# Altium project SkyRacer_V2.0.PrjPcb
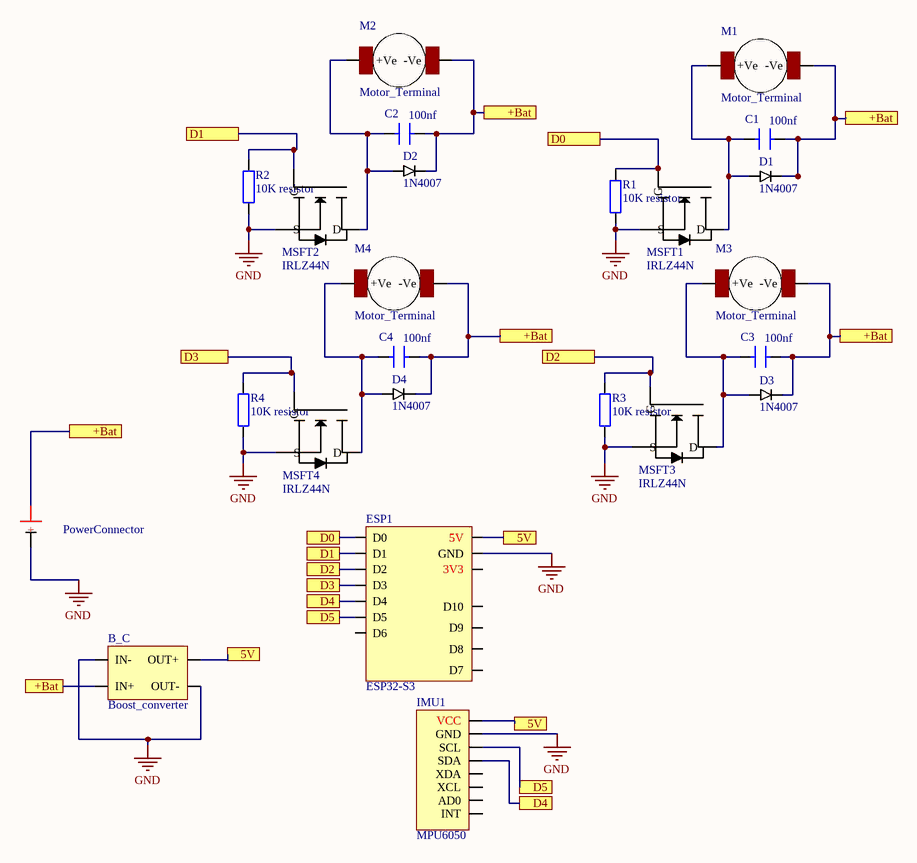
[diagram p0: Schematic.SchDoc]
1 sheet, 24 parts. Net scope: flat (ports and power ports of the same name join across sheets).
Board file: pCb12.PcbDoc

## Sheet Schematic.SchDoc
size A; SheetNumber: 1; SheetTotal: 1

### Parts
B1  PowerConnector  [Power]
B_C  Boost_converter  [Boost_5V]
C1  100nf  [TH_Capacitor]
C2  100nf  [TH_Capacitor]
C3  100nf  [TH_Capacitor]
C4  100nf  [TH_Capacitor]
D1  1N4007  [TH_Diode]
D2  1N4007  [TH_Diode]
D3  1N4007  [TH_Diode]
D4  1N4007  [TH_Diode]
ESP1  ESP32-S3  [ESP-S3-Seed-Studio]
IMU1  MPU6050  [MPU-8-pins]
M1  Motor_Terminal  [Motor Connector]
M2  Motor_Terminal  [Motor Connector]
M3  Motor_Terminal  [Motor Connector]
M4  Motor_Terminal  [Motor Connector]
MSFT1  IRLZ44N  [TH_MOSFET_IRLB8721]
MSFT2  IRLZ44N  [TH_MOSFET_IRLB8721]
MSFT3  IRLZ44N  [TH_MOSFET_IRLB8721]
MSFT4  IRLZ44N  [TH_MOSFET_IRLB8721]
R1  10K resistor  [TH_resistor]
R2  10K resistor  [TH_resistor]
R3  10K resistor  [TH_resistor]
R4  10K resistor  [TH_resistor]

### Ports
5V, +Bat, D0, D1, D2, D3, D4, D5

### Nets
GND: B1.2(-) B_C.2(IN-) B_C.4(OUT-) ESP1.2(GND) IMU1.2(GND) MSFT1.3(S) MSFT2.3(S) MSFT3.3(S) MSFT4.3(S) R1.2 R2.2 R3.2 R4.2
NetB1_1: B1.1(+) B_C.1(IN+) C1.2 C2.2 C3.2 C4.2 D1.2 D2.2 D3.2 D4.2 M1.1(-Ve) M2.1(-Ve) M3.1(-Ve) M4.1(-Ve) ; port +Bat
NetB_C_3: B_C.3(OUT+) ESP1.1(5V) IMU1.1(VCC) ; port 5V
NetC1_1: C1.1 D1.1 M1.2(+Ve) MSFT1.2(D)
NetC2_1: C2.1 D2.1 M2.2(+Ve) MSFT2.2(D)
NetC3_1: C3.1 D3.1 M3.2(+Ve) MSFT3.2(D)
NetC4_1: C4.1 D4.1 M4.2(+Ve) MSFT4.2(D)
NetESP1_8: ESP1.8(D0) MSFT1.1(G) R1.1 ; port D0
NetESP1_9: ESP1.9(D1) MSFT2.1(G) R2.1 ; port D1
NetESP1_10: ESP1.10(D2) MSFT3.1(G) R3.1 ; port D2
NetESP1_11: ESP1.11(D3) MSFT4.1(G) R4.1 ; port D3
NetESP1_12: ESP1.12(D4) IMU1.4(SDA) ; port D4
NetESP1_13: ESP1.13(D5) IMU1.3(SCL) ; port D5

Not connected (* = marked no-connect by the designer): ESP1 3(3V3) 4(D10) 5(D9) 6(D8) 7(D7) 14(D6); IMU1 5(XDA) 6(XCL) 7(AD0) 8(INT)

### Library data of the parts
C1-C4 = Capacitor
R1-R4 = R_10K